# EAGLE design rj45Wing (EAGLE 9.6.2)
COMPANY: ADAFRUIT INDUSTRIES; DRAWN: KTOWN; REV: B
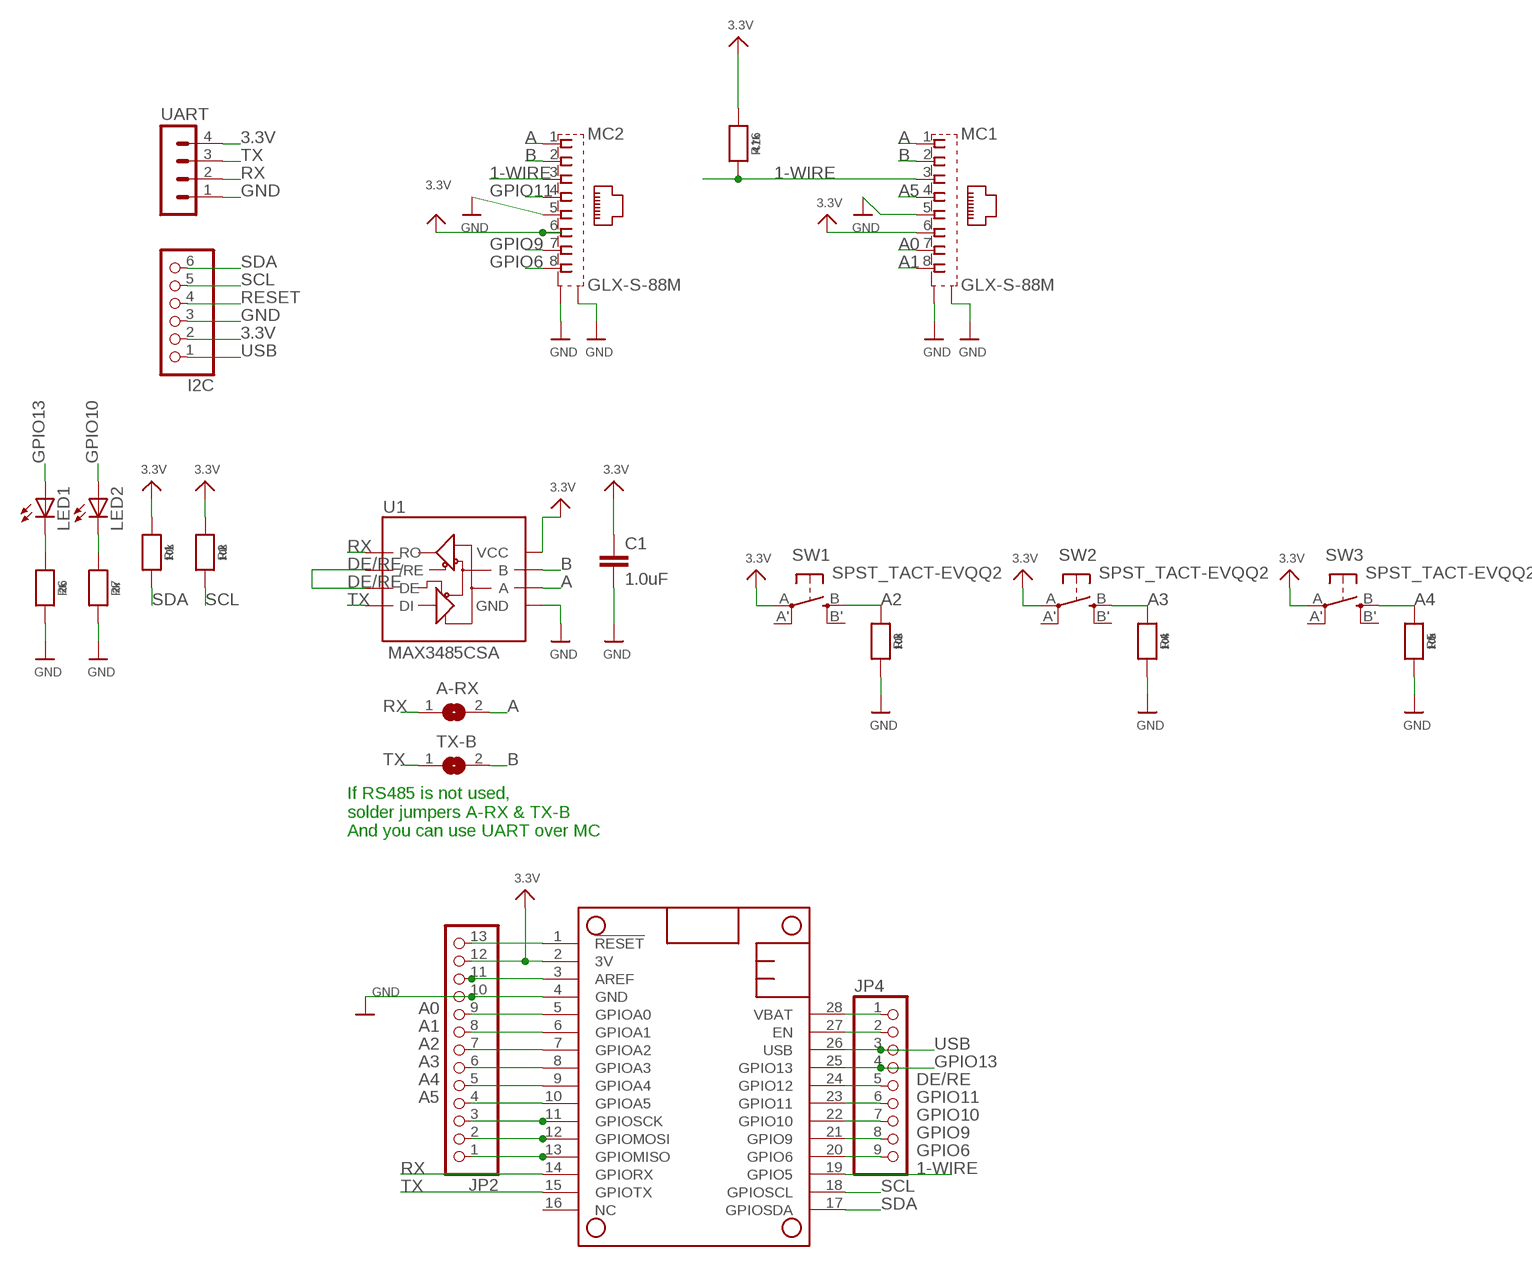
[diagram p0: schematic, sheet 1]

## Parts
A-RX  SJ  [SJ]
C1  1.0uF  1.0UF-0402-16V-10%  [0402]
I2C  PINHD-1X6  [1X06]
JP2  HEADER-1X13  [1X13_ROUND_70]
JP4  HEADER-1X970MIL  [1X09_ROUND_70]
LED1  LEDCHIP-LED0805  [CHIP-LED0805]
LED2  LEDCHIP-LED0805  [CHIP-LED0805]
MC1  GLX-S-88M  [GLX-S-88M]
MC2  GLX-S-88M  [GLX-S-88M]
MS1  FEATHERWING_NODIM  [FEATHERWING_NODIM]
R1  10k  RESISTOR_0603_NOOUT  [0603-NO]
R2  10k  RESISTOR_0603_NOOUT  [0603-NO]
R3  10k  RESISTOR_0603_NOOUT  [0603-NO]
R4  10k  RESISTOR_0603_NOOUT  [0603-NO]
R5  10k  RESISTOR_0603_NOOUT  [0603-NO]
R6  2k  RESISTOR_0603_NOOUT  [0603-NO]
R7  2k  RESISTOR_0603_NOOUT  [0603-NO]
R16  4.7k  RESISTOR_0603_NOOUT  [0603-NO]
SW1  SPST_TACT-EVQQ2  [EVQ-Q2]
SW2  SPST_TACT-EVQQ2  [EVQ-Q2]
SW3  SPST_TACT-EVQQ2  [EVQ-Q2]
TX-B  SJ  [SJ]
U1  MAX3485CSA  RS485SOIC  [SO08]
UART  MA04-1  [MA04-1]

## Nets
1-WIRE: MC1.3 MC2.3 MS1.19(GPIO5) R16.2
3.3V: C1.1 I2C.2 JP2.12 MC1.6 MC2.6 MS1.2(3V) R1.1 R2.1 R16.1 SW1.A(P) SW2.A(P) SW3.A(P) U1.8(VCC) UART.4
A [Diff]: A-RX.2 MC1.1 MC2.1 U1.6(A)
A0: JP2.9 MC1.7 MS1.5(GPIOA0)
A1: JP2.8 MC1.8 MS1.6(GPIOA1)
A2: JP2.7 MS1.7(GPIOA2) R3.1 SW1.B(S)
A3: JP2.6 MS1.8(GPIOA3) R4.1 SW2.B(S)
A4: JP2.5 MS1.9(GPIOA4) R5.1 SW3.B(S)
A5: JP2.4 MC1.4 MS1.10(GPIOA5)
B [Diff]: MC1.2 MC2.2 TX-B.2 U1.7(B)
DE/RE: JP4.5 MS1.24(GPIO12) U1.2(/RE) U1.3(DE)
GND: C1.2 I2C.3 JP2.10 MC1.5 MC1.S1 MC1.S2 MC2.5 MC2.S1 MC2.S2 MS1.4(GND) R3.2 R4.2 R5.2 R6.2 R7.2 U1.5(GND) UART.1
GPIO6: JP4.9 MC2.8 MS1.20(GPIO6)
GPIO9: JP4.8 MC2.7 MS1.21(GPIO9)
GPIO10: JP4.7 LED2.A MS1.22(GPIO10)
GPIO11: JP4.6 MC2.4 MS1.23(GPIO11)
GPIO13: JP4.4 LED1.A MS1.25(GPIO13)
MISO_MCU: JP2.1 MS1.13(GPIOMISO)
MOSI: JP2.2 MS1.12(GPIOMOSI)
N$1: LED1.C R6.1
N$3: LED2.C R7.1
N$15: JP4.2 MS1.27(EN)
N$22: JP2.13 MS1.1(!RESET)
N$34: JP2.11 MS1.3(AREF)
RESET: I2C.4
RX [Diff]: A-RX.1 MS1.14(GPIORX) U1.1(RO) UART.2
SCK: JP2.3 MS1.11(GPIOSCK)
SCL: I2C.5 MS1.18(GPIOSCL) R2.2
SDA: I2C.6 MS1.17(GPIOSDA) R1.2
TX [Diff]: MS1.15(GPIOTX) TX-B.1 U1.4(DI) UART.3
USB: I2C.1 JP4.3 MS1.26(USB)
VBAT: JP4.1 MS1.28(VBAT)
Unconnected: MS1.16(NC) SW1.A'(P1) SW1.B'(S1) SW2.A'(P1) SW2.B'(S1) SW3.A'(P1) SW3.B'(S1)

## Notes on the sheet
- If RS485 is not used,
  solder jumpers A-RX & TX-B 
  And you can use UART over MC

## Library data of the parts
A-RX TX-B = jumper:SJ: SMD solder JUMPER
C1 = SparkFun-Capacitors:1.0UF: 1µF ceramic capacitors A capacitor is a passive two-terminal electrical component used to store electrical energy temporarily in an electric field.; PROD_ID: CAP-12417
I2C = adafruit:PINHD-1X6: PIN HEADER
JP2 = microbuilder:HEADER-1X13
JP4 = microbuilder:HEADER-1X9: PIN HEADER
LED1 LED2 = adafruit:LED: LED OSRAM: - CHIPLED LG R971, LG N971, LY N971, LG Q971, LY Q971, LO R971, LY R971 LH N974, LH R974 LS Q976, LO Q976, LY Q976 LO Q996 - Hyper CHIPLED LW Q18S LB Q993, LB Q99A, LB R99A - SideLED LS A670, LO A670, LY A670, LG A670, LP A670 LB A673, LV A673, LT A673, LW A673 LH A674 LY A675 LS A676, LA A676, LO A676, LY A676, LW A676 LS A679, LY A679, LG A679 - Hyper Micro SIDELED® LS Y876, LA Y876, LO Y876, LY Y876 LT Y87S - SmartLED LW L88C, LW L88S LB L89C, LB L89S, LG L890 LS L89K, LO L89K, LY L89K LS L896, LA L896, LO L896, LY L896 - TOPLED LS T670, LO T670, LY T670, LG T670, LP T670 LSG T670, LSP T670, LSY T670, LOP T670, LYG T670 LG T671, LOG T671, LSG T671 LB T673, LV T673, LT T673, LW T673 LH T674 LS T676, LA T676, LO T676, LY T676, LB T676, LH T676, LSB T676, LW T676 LB T67C, LV T67C, LT T67C, LS T67K, LO T67K, LY T67K, LW E67C LS E67B, LA E67B, LO E67B, LY E67B, LB E67C, LV E67C, LT E67C LW T67C LS T679, LY T679, LG T679 LS T770, LO T770, LY T770, LG T770, LP T770 LB T773, LV T773, LT T773, LW T773 LH T774 LS E675, LA E675, LY E675, LS T675 LS T776, LA T776, LO T776, LY T776, LB T776 LHGB T686 LT T68C, LB T68C - Hyper Mini TOPLED® LB M676 - Mini TOPLED Santana® LG M470 LS M47K, LO M47K, LY M47K Source: http://www.osram.convergy.de/
MC1 MC2 = con-kycon:GLX-S-88M: Mod. Jack, Right Angle, 8 posiotion, 8 contatcs RJ45 Source: GLX-S-88M.pdf; OC_FARNELL: unknown; OC_NEWARK: unknown
MS1 = microbuilder:FEATHERWING
R1-R7 R16 = microbuilder:RESISTOR: Resistors For new designs, use the packages preceded by an '_' character since they are more reliable: The following footprints should be used on most boards: _0402 - Standard footprint for regular board layouts _0603 - Standard footprint for regular board layouts _0805 - Standard footprint for regular board layouts _1206 - Standard footprint for regular board layouts For extremely tight-pitch boards where space is at a premium, the following 'micro-pitch' footprints can be used (smaller pads, no silkscreen outline, etc.): _0402MP - Micro-pitch footprint for very dense/compact boards _0603MP - Micro-pitch footprint for very dense/compact boards _0805MP - Micro-pitch footprint for very dense/compact boards _1206MP - Micro-pitch footprint for very dense/compact boards
SW1-SW3 = adafruit:SPST_TACT: SMT 6mm switch, EVQQ2 series http://www.ladyada.net/library/eagle
U1 = SparkFun-IC-Comms:RS485: RS-485 Transceiver SP3485 Series 8 Pin NSOIC 3.3 V Low Power Half Duplex RS-485 Transceiver MAX3485 compatible Datasheet <http://www.sparkfun.com/datasheets/Components/General/sp3485CN-LTR.pdf> SparkFun Products SparkFun Transceiver Breakout - RS-485 <https://www.sparkfun.com/products/10124> (BOB-10124) SparkFun USB to RS-485 Converter <https://www.sparkfun.com/products/9822> (BOB-09822); PROD_ID: IC-09388
UART = con-lstb:MA04-1: PIN HEADER; OC_FARNELL: unknown; OC_NEWARK: unknown

## Module SO8
Ports: 

### Library data of the parts

## Net classes
1 Diff: width 0.203 mm

## Board
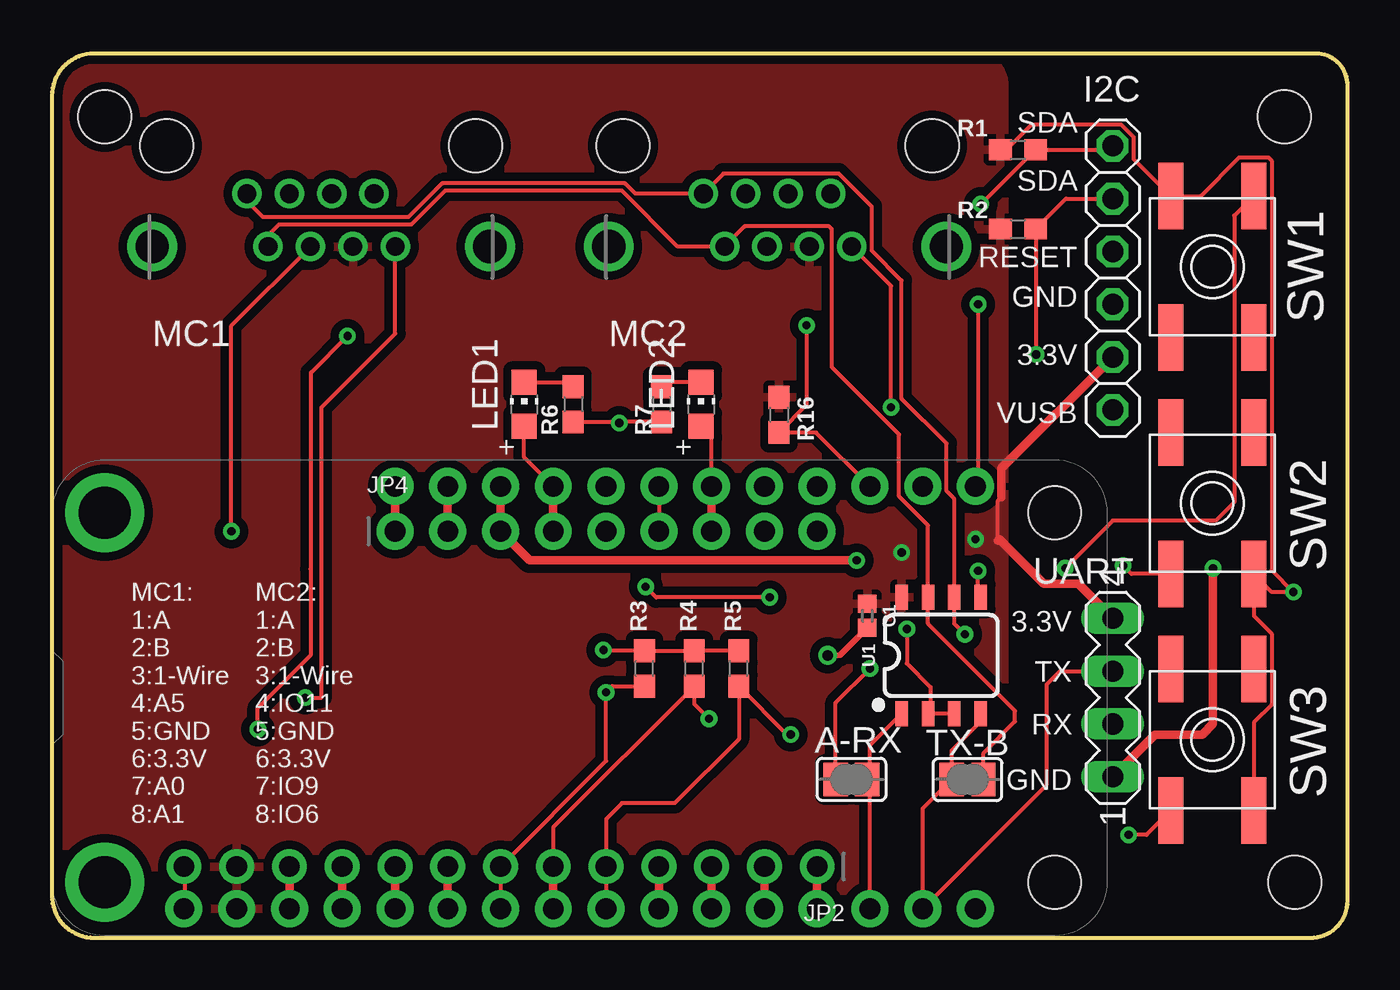
[diagram p1: board, top side]
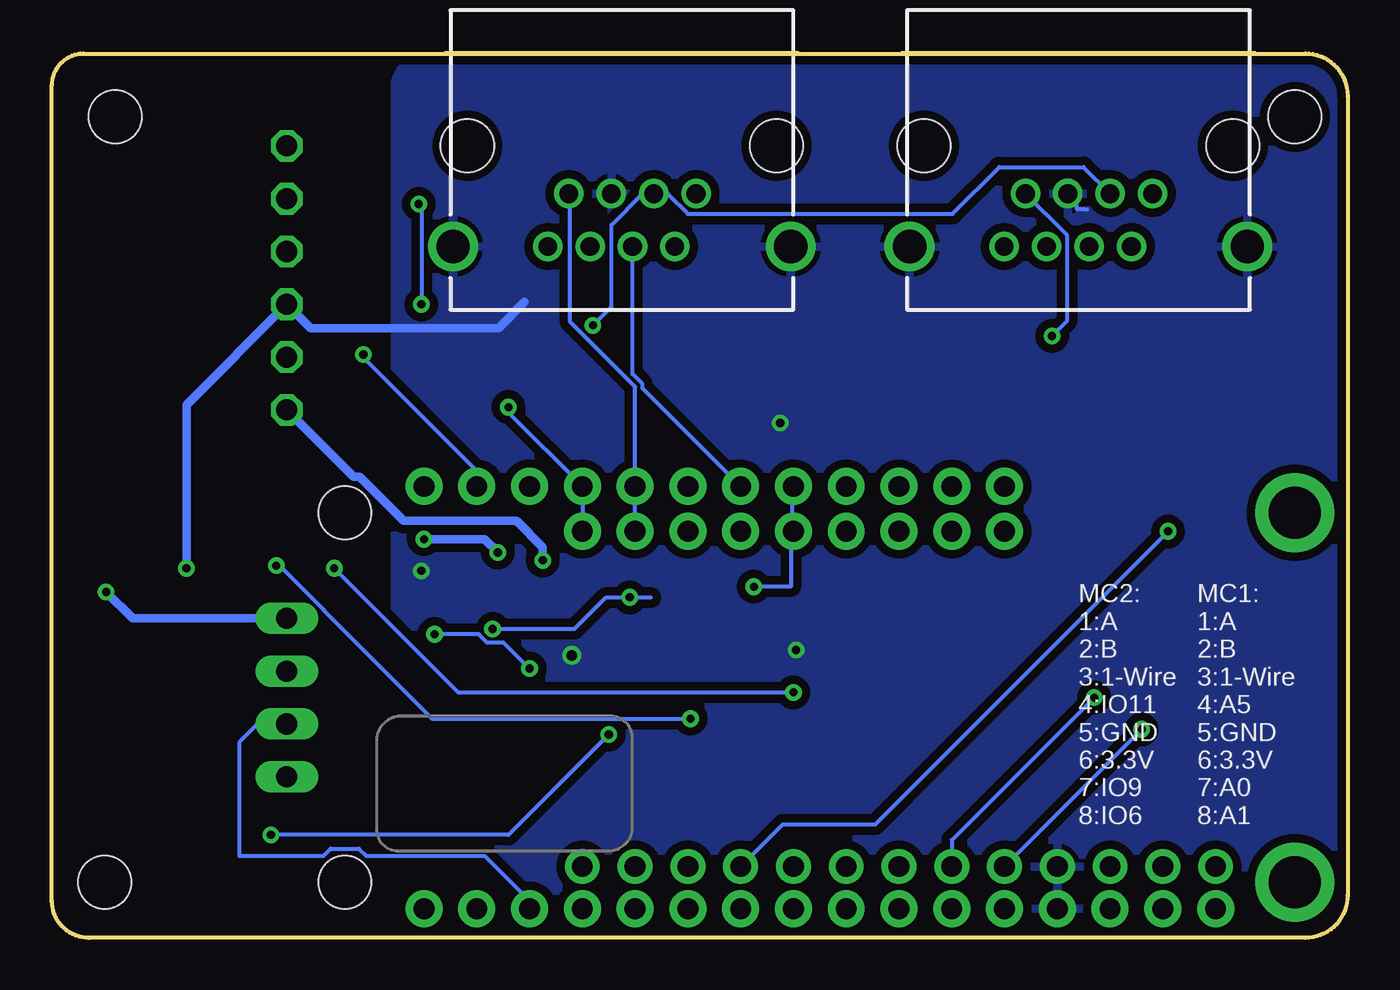
[diagram p2: board, bottom side, seen from below]

Size 62.36 x 42.55 mm. Coordinates in mm from the lower left corner, seen from the top.
Outline: 0,40.51 0,2.03 arc90 2.03,0 60.58,0 arc90 62.36,1.78 62.36,41.02 arc90 60.83,42.55 2.03,42.55 arc90 0,40.51
Copper layers (1*16): Top 0.035mm / dielectric 1.5mm / Bottom 0.035mm
Design rules "adafruit *": minimum track width 8mil, minimum drill 15.5mil, track to track 6mil, track to pad 6mil, pad to pad 6mil, via to via 6mil, smd to smd 6mil, copper to edge 10mil, drill to drill 8mil, minimum pad ring 10mil, minimum via ring 8mil, stop-mask expansion 2mil, vias tented up to drill 20mil, thermal gap 10mil
Holes 2.54 mm at 2.54,39.5 59.31,39.5 59.82,2.67

### Footprints (pad centres in the part's own frame; a part is rotated, then mirrored left to right if it is on the bottom)
SJ = smd 1.168 x 1.6: 1 -0.762,0; 2 0.762,0
0402 = smd 0.85 x 0.9: 1 -0.58,0; 2 0.58,0
1X06 = drill 1.016 octagon: 1 -6.35,0; 2 -3.81,0; 3 -1.27,0; 4 1.27,0; 5 3.81,0; 6 6.35,0
1X13_ROUND_70 = drill 1 pad 1.676: 1 -15.24,0; 2 -12.7,0; 3 -10.16,0; 4 -7.62,0; 5 -5.08,0; 6 -2.54,0; 7 0,0; 8 2.54,0; 9 5.08,0; 10 7.62,0; 11 10.16,0; 12 12.7,0; 13 15.24,0
1X09_ROUND_70 = drill 1 pad 1.778: 1 -10.16,0; 2 -7.62,0; 3 -5.08,0; 4 -2.54,0; 5 0,0; 6 2.54,0; 7 5.08,0; 8 7.62,0; 9 10.16,0
CHIP-LED0805 = smd 1.2 x 1.2: A 0,-1.05; C 0,1.05
GLX-S-88M = drill 0.9 pad 1.422: 1 -3.57,-2.3; 2 -2.55,-4.84; 3 -1.53,-2.3; 4 -0.51,-4.84; 5 0.51,-2.3; 6 1.53,-4.84; 7 2.55,-2.3; 8 3.57,-4.84 | drill 1.6 pad 2.184: S1 -8.125,-4.84; S2 8.125,-4.84 | hole 2.55: -7.44,0; 7.44,0
FEATHERWING_NODIM = drill 1 pad 1.778: 1 6.35,1.27; 2 8.89,1.27; 3 11.43,1.27; 4 13.97,1.27; 5 16.51,1.27; 6 19.05,1.27; 7 21.59,1.27; 8 24.13,1.27; 9 26.67,1.27; 10 29.21,1.27; 11 31.75,1.27; 12 34.29,1.27; 13 36.83,1.27; 14 39.37,1.27; 15 41.91,1.27; 16 44.45,1.27; 17 44.45,21.59; 18 41.91,21.59; 19 39.37,21.59; 20 36.83,21.59; 21 34.29,21.59; 22 31.75,21.59; 23 29.21,21.59; 24 26.67,21.59; 25 24.13,21.59; 26 21.59,21.59; 27 19.05,21.59; 28 16.51,21.59 | drill 2.5 pad 3.81: P$1 2.54,20.32; P$2 2.54,2.54 | hole 2.54: 48.26,20.32; 48.26,2.54
0603-NO = smd 1.1 x 1: 1 -0.85,0; 2 0.85,0
EVQ-Q2 = smd 3.2 x 1.2: A -3.4,-2; A' 3.4,-2; B -3.4,2; B' 3.4,2
SO08 = smd 0.6 x 1.2: 1 -1.905,-2.8; 2 -0.635,-2.8; 3 0.635,-2.8; 4 1.905,-2.8; 5 1.905,2.8; 6 0.635,2.8; 7 -0.635,2.8; 8 -1.905,2.8
MA04-1 = drill 1.016 long: 1 -3.81,0; 2 -1.27,0; 3 1.27,0; 4 3.81,0

### Placement (x,y rotation side)
A-RX  38.48,7.62 180 top
C1  39.24,15.49 270 top
I2C  51.05,31.75 90 top
JP2  21.59,3.43 180 top
JP4  26.67,19.56 0 top
LED1  22.73,25.67 0 top
LED2  31.24,25.67 0 top
MC1  12.95,38.1 0 top
MC2  34.92,38.1 0 top
MS1  0,0.13 0 top
R1  46.49,37.91 0 top
R2  46.49,34.1 0 top
R3  28.52,12.95 90 top
R4  30.92,12.95 90 top
R5  33.06,12.95 90 top
R6  25.08,25.67 270 top
R7  29.34,25.67 270 top
R16  34.99,25.16 270 top
SW1  55.85,32.29 270 top
SW2  55.85,20.91 90 top
SW3  55.85,9.53 90 top
TX-B  44.07,7.62 0 top
U1  42.8,13.59 0 top
UART  51.05,11.56 90 top

### Tracks (layer width: path | path; a pad name or v marks a point on that pad's centre or on a via)
1-WIRE  (via drill 0.39)
  Top 0.203: MS1.19 36.78,24.31 R16.2 36.32,25.64 v36.32,29.46
  Bottom 0.203: v36.32,29.46 35.43,30.35 35.43,34.29 33.92,35.8 MC2.3 32.72,35.8 31.75,34.84 19.01,34.84 16.76,37.08 12.71,37.08 MC1.3
3.3V  (via drill 0.39)
  Top 0.203: SW3.A 57.85,10.37 58.7,11.22 58.7,14.63 57.85,15.49 SW2.A 58.72,16.64 v59.75,16.64 58.7,17.69 58.7,37.4 58.55,37.54 57.14,37.54 55.29,35.69 SW1.A 52.07,37.47 52.07,38.52 51.48,39.12 47.14,39.12 45.93,37.91 R1.1 | 45.53,19.11 45.53,21.04 45.7,21.2
  Top 0.406: UART.4 49.4,17.02 47.75,17.02 45.59,19.18 45.53,19.11 | I2C.2 45.7,22.58 45.7,21.2
  Bottom 0.406: v40.89,18.54 41.53,19.18 v44.45,19.18 | UART.4 58.48,15.37 v59.75,16.64
  pour Top (isolate 0.406): 0.13,39.75 arc-90 2.79,42.42 44.45,42.42 arc-90 45.85,41.02 45.85,0.38 arc-90 45.34,-0.13 2.29,-0.13 arc-90 0.13,2.03
A  (via drill 0.39)
  Top 0.203: A-RX.2 37.72,11.3 v39.37,12.95 | v43.94,14.61 43.43,15.11 U1.6 43.43,21.12 43.05,21.5 43.05,23.79 40.89,25.94 40.89,31.62 39.46,33.06 39.46,35.18 37.88,36.77 32.32,36.77 MC2.1 28.08,35.8 27.58,36.3 18.78,36.3 17.15,34.67 10.16,34.67 9.38,35.45 MC1.1
  Bottom 0.203: v39.37,12.95 40.62,14.21 41.42,14.21 41.82,14.61 v43.94,14.61
A0  (via drill 0.39)
  Top 0.203: v9.91,10.03 9.91,11.05 12.45,13.59 12.45,17.74 12.46,17.76 12.46,27.2 v14.22,28.96
  Top 0.406: MS1.5 JP2.9
  Bottom 0.203: JP2.9 v9.91,10.03 | v14.22,28.96 13.52,29.66 13.52,33.82 MC1.7
A1  (via drill 0.39)
  Top 0.203: MC1.8 16.52,29.07 12.97,25.52 12.97,11.56 v12.19,11.56
  Top 0.406: JP2.8 MS1.6
  Bottom 0.203: v12.19,11.56 19.05,4.7 JP2.8
A2  (via drill 0.39)
  Top 0.203: SW1.B 56.9,34.74 56.9,20.95 56.01,20.07 51.05,20.07 v48.77,17.78 | R3.1 26.96,12.1 v26.67,11.81 26.67,8.51 JP2.7 MS1.7
  Bottom 0.203: v48.77,17.78 42.8,11.81 v26.67,11.81
A3  (via drill 0.39)
  Top 0.203: SW2.B 51.96,17.51 v51.56,17.91 | v31.62,10.54 30.91,11.25 R4.1 24.13,5.32 JP2.6
  Top 0.406: JP2.6 MS1.8
  Bottom 0.203: v51.56,17.91 51.4,17.91 49.28,15.79 49.28,15.75 44.07,10.54 v31.62,10.54
A4  (via drill 0.39)
  Top 0.203: SW3.B 52.67,4.95 v51.82,4.95 | v35.56,9.78 35.38,9.78 R5.1 33.06,9.56 29.97,6.48 27.43,6.48 26.67,5.71 JP2.5 MS1.9
  Bottom 0.203: v35.56,9.78 40.39,4.95 v51.82,4.95
A5  (via drill 0.39)
  Top 0.203: v8.64,19.56 8.64,29.45 MC1.4
  Top 0.406: JP2.4 MS1.10
  Bottom 0.203: JP2.4 27.18,5.46 22.73,5.46 v8.64,19.56
B
  Top 0.203: TX-B.2 44.83,8.89 46.35,10.41 46.35,10.92 42.16,15.11 U1.7 42.16,19.85 40.77,21.24 40.77,24.22 37.53,27.46 37.53,34.1 37.4,34.23 33.34,34.23 MC2.2 30.12,33.26 27.43,35.94 18.93,35.94 17.3,34.32 10.92,34.32 10.4,33.8 MC1.2
DE/RE  (via drill 0.39)
  Top 0.203: 42.23,10.86 42.29,10.92 42.29,12.07 41.15,13.21 v41.15,14.86 | 42.23,10.86 U1.2 | U1.3 42.3,10.79 42.23,10.86 | v34.54,16.38 29.08,16.38 v28.57,16.89
  Bottom 0.203: JP4.5 26.73,19.49 | 26.73,19.49 26.8,19.43 26.8,16.89 v28.57,16.89 | v41.15,14.86 37.21,14.86 35.69,16.38 v34.54,16.38 33.53,16.38 | MS1.24 26.73,21.65 26.73,19.49
GND  (via drill 0.39, 0.5)
  Top 0.203: R5.2 R4.2 | R4.2 | R4.2 R3.2 26.58,13.8 v26.54,13.84 | U1.5 44.58,16.52 v44.58,17.65 | R6.2 27.25,24.82 | 27.25,24.82 v27.3,24.77 | R7.2 27.25,24.82
  Top 0.254: C1.2 37.92,13.59 v37.34,13.59
  Top 0.406: JP2.10 MS1.4 | UART.1 53.09,9.78 55.37,9.78 55.88,10.29 v55.88,17.78
  Bottom 0.203: MC1.5 13.34,35.69 13.02,35.37 13.02,35.05 12.7,35.05 12.54,35.05
  Bottom 0.406: 39.61,30.59 40.87,29.34 49.91,29.34 I2C.3 55.88,25.65 v55.88,17.78
  pour Bottom (isolate 0.406): 0.13,39.75 arc-90 2.54,42.16 44.7,42.16 arc-90 45.85,41.02 45.85,0.64 arc-90 45.09,-0.13 2.54,-0.13 arc-90 0.13,2.29
GPIO6  (via drill 0.39)
  Top 0.203: v40.39,25.53 40.39,31.37 MC2.8
  Bottom 0.203: JP4.9 MS1.20 40.39,25.27 v40.39,25.53
GPIO9
  Bottom 0.203: JP4.8 MS1.21 34.29,26.51 37.42,29.64 37.42,35.75 MC2.7
GPIO10
  Top 0.203: MS1.22 31.75,24.11 LED2.A
  Top 0.406: MS1.22 JP4.7
GPIO11
  Top 0.203: MS1.23 JP4.6
  Bottom 0.203: MS1.23 33.93,26.44 33.93,26.65 34.41,27.13 MC2.4
GPIO13
  Top 0.203: MS1.25 22.73,23.11 LED1.A
  Top 0.406: MS1.25 JP4.4
MISO_MCU
  Top 0.406: JP2.1 MS1.13
MOSI
  Top 0.406: JP2.2 MS1.12
N$1
  Top 0.203: LED1.C 24.88,26.72 R6.1
N$3
  Top 0.203: LED2.C 29.54,26.72 R7.1
N$15
  Top 0.406: MS1.27 JP4.2
N$22
  Top 0.203: JP2.13 6.4,3.33 6.4,1.55 MS1.1
N$34
  Top 0.406: JP2.11 MS1.3
RX
  Top 0.203: MS1.14 39.37,7.75 | U1.1 39.37,9.27 39.37,7.75 | A-RX.1 39.37,7.75
  Bottom 0.203: UART.2 52.45,10.29 53.34,9.4 53.34,3.94 49.29,3.94 48.93,4.29 47.59,4.29 47.23,3.94 41.53,3.94 39.37,1.78 MS1.14
SCK
  Top 0.406: JP2.3 MS1.11
SCL  (via drill 0.39)
  Top 0.203: v47.37,28.07 47.37,34.07 R2.2 48.8,35.56 I2C.5
  Bottom 0.203: MS1.18 41.91,22.48 47.37,27.94 v47.37,28.07
SDA  (via drill 0.39)
  Top 0.203: I2C.6 50.86,37.91 R1.2 44.74,35.31 v44.7,35.31 | v44.58,30.48 44.58,21.84 MS1.17
  Bottom 0.203: v44.7,35.31 44.58,35.18 v44.58,30.48
TX
  Top 0.203: U1.4 44.7,10.41 43.31,9.02 TX-B.1 41.91,6.22 MS1.15 47.88,7.37 47.88,12.19 48.51,12.83 UART.3
USB  (via drill 0.39)
  Top 0.406: MS1.26 JP4.3 22.99,18.16 v38.73,18.16
  Bottom 0.406: I2C.1 47.83,22.17 47.55,22.17 45.44,20.07 40.01,20.07 38.73,18.8 v38.73,18.16
VBAT
  Top 0.406: MS1.28 JP4.1

### Text on the board
tNames: SDA | SDA | RESET | GND | SW1 | 3.3V | VUSB | SW2 | 3.3V | TX | RX | GND | SW3 | MC1: / 1:A / 2:B / 3:1-Wire / 4:A5 / 5:GND / 6:3.3V / 7:A0 / 8:A1 | MC2: / 1:A / 2:B / 3:1-Wire / 4:IO11 / 5:GND / 6:3.3V / 7:IO9 / 8:IO6
bNames: MC1: / 1:A / 2:B / 3:1-Wire / 4:A5 / 5:GND / 6:3.3V / 7:A0 / 8:A1 | MC2: / 1:A / 2:B / 3:1-Wire / 4:IO11 / 5:GND / 6:3.3V / 7:IO9 / 8:IO6
bDocu: Uart --> Rj45 (No 485)